# EAGLE design usain_bot_chasis (EAGLE 8.6.0)
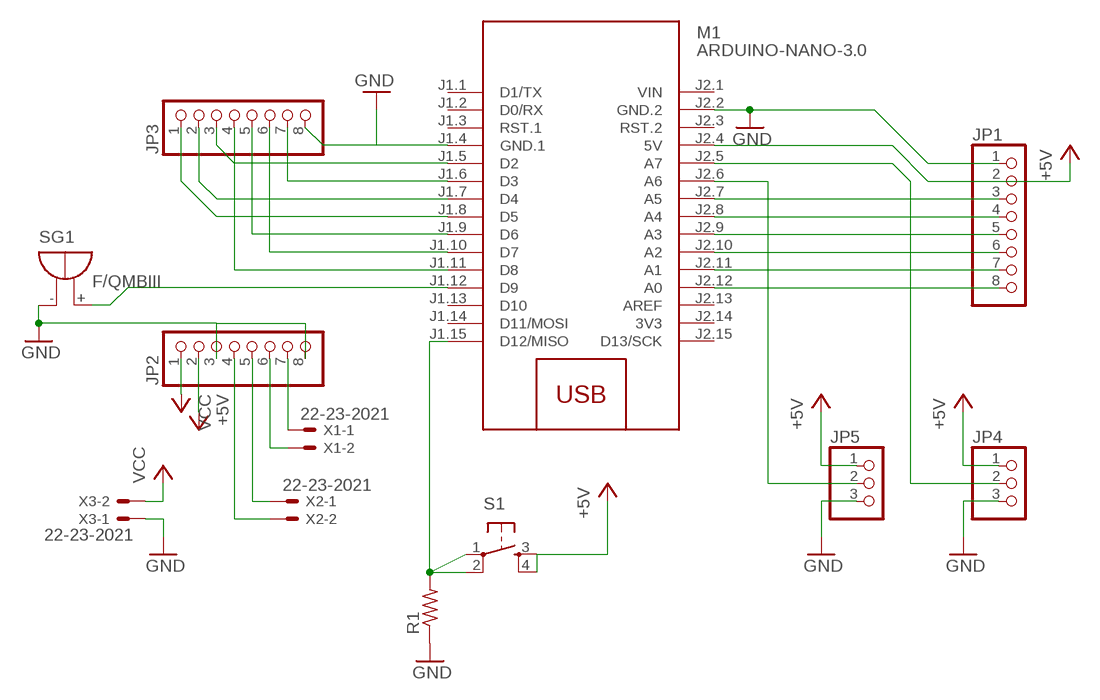
[diagram p0: schematic, sheet 1]

## Parts
JP1  PINHD-1X8BIG  [1X08-BIG]
JP2  PINHD-1X8BIG  [1X08-BIG]
JP3  PINHD-1X8BIG  [1X08-BIG]
JP4  PINHD-1X3  [1X03]
JP5  PINHD-1X3  [1X03]
M1  ARDUINO-NANO-3.0  [ARDUINO-NANO-3.0]
R1  R-US_0207/7  [0207/7]
S1  TAC_SWITCHPTH  [TACTILE-PTH]
SG1  F/QMBIII  [F/QMBIII]
X1  22-23-2021  [22-23-2021]
X2  22-23-2021  [22-23-2021]
X3  22-23-2021  [22-23-2021]

## Nets
+5V: JP1.2 JP2.2 JP4.1 JP5.1 M1.J2.4(5V) S1.3 S1.4
GND: JP1.1 JP2.3 JP2.8 JP3.8 JP4.3 JP5.3 M1.J1.4(GND.1) M1.J2.2(GND.2) R1.1 SG1.-(+) X3.1
N$1: JP1.8 M1.J2.12(A0)
N$2: JP1.7 M1.J2.11(A1)
N$3: JP1.6 M1.J2.10(A2)
N$4: JP1.5 M1.J2.9(A3)
N$5: JP1.4 M1.J2.8(A4)
N$6: JP1.3 M1.J2.7(A5)
N$8: M1.J1.15(D12/MISO) R1.2 S1.1 S1.2
N$9: JP3.7 M1.J1.6(D3)
N$10: JP3.1 M1.J1.8(D5)
N$11: JP3.2 M1.J1.7(D4)
N$12: JP3.3 M1.J1.5(D2)
N$14: JP3.5 M1.J1.9(D6)
N$15: JP3.6 M1.J1.10(D7)
N$16: JP3.4 M1.J1.11(D8)
N$17: JP2.4 X2.2
N$18: JP2.5 X2.1
N$19: JP2.6 X1.2
N$20: JP2.7 X1.1
N$21: M1.J1.12(D9) SG1.+(-)
N$22: JP5.2 M1.J2.6(A6)
N$23: JP4.2 M1.J2.5(A7)
VCC: JP2.1 X3.2
Unconnected: M1.J1.1(D1/TX) M1.J1.2(D0/RX) M1.J1.3(RST.1) M1.J1.13(D10) M1.J1.14(D11/MOSI) M1.J2.3(RST.2) M1.J2.13(AREF) M1.J2.15(D13/SCK)

## Power pins joined to a net without a drawn wire
3V3: M1.J2.14(3V3)
VIN: M1.J2.1(VIN)

## Library data of the parts
JP1-JP3 = adafruit:PINHD-1X8: PIN HEADER
JP4 JP5 = adafruit:PINHD-1X3: PIN HEADER
M1 = diy-modules:ARDUINO-NANO-3.0: Arduino Nano 3.0 and compatible devices More details available here: https://www.arduino.cc/en/Main/ArduinoBoardNano Click here to find device on ebay.com <http://www.ebay.com/sch/arduino+nano>
R1 = resistor:R-US_: RESISTOR, American symbol
S1 = SparkFun-Retired:TAC_SWITCH: Momentary Switch Button commonly used for reset or general input. Spark Fun Electronics SKU : COM-00097 SMT- SWCH-08247
SG1 = buzzer:F/QMBIII: BUZZER Source: Buerklin; OC_FARNELL: unknown; OC_NEWARK: unknown
X1-X3 = con-molex:22-23-2021: .100" (2.54mm) Center Header - 2 Pin; MF: MOLEX; MPN: 22-23-2021; OC_FARNELL: 1462926; OC_NEWARK: 25C3832

## Board
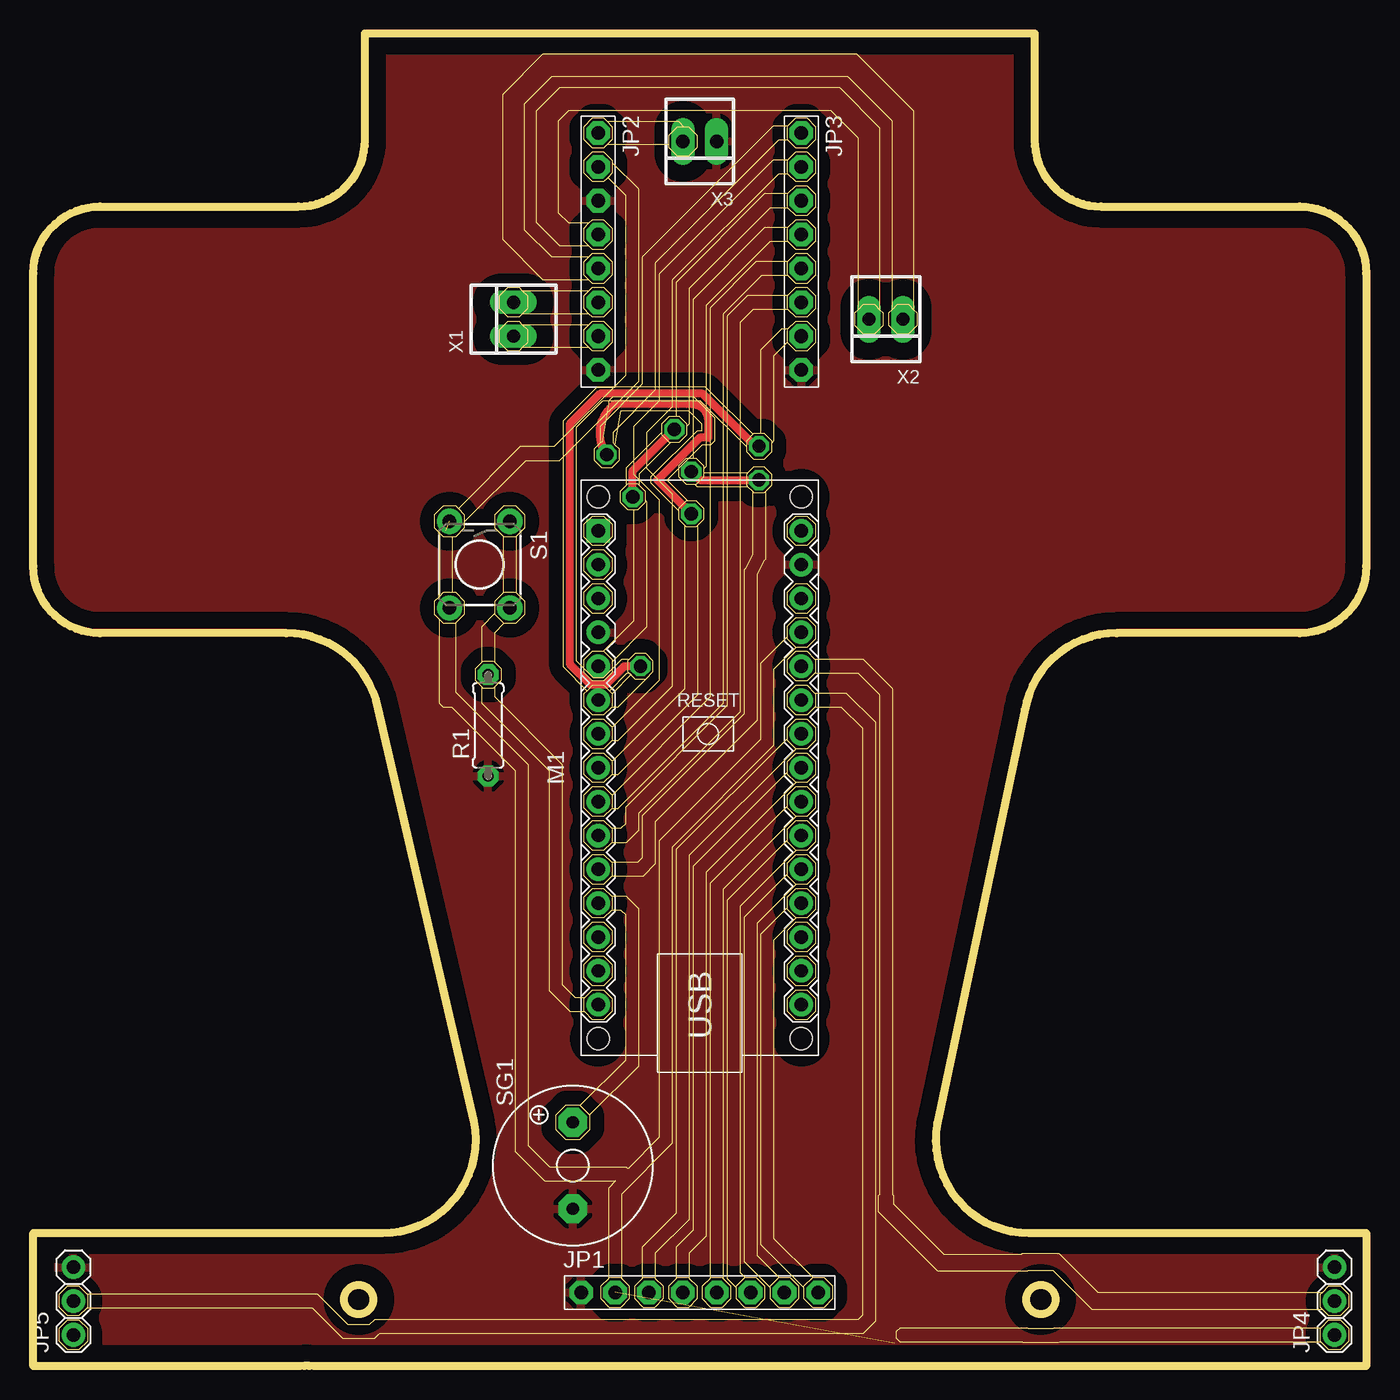
[diagram p1: board, top side]
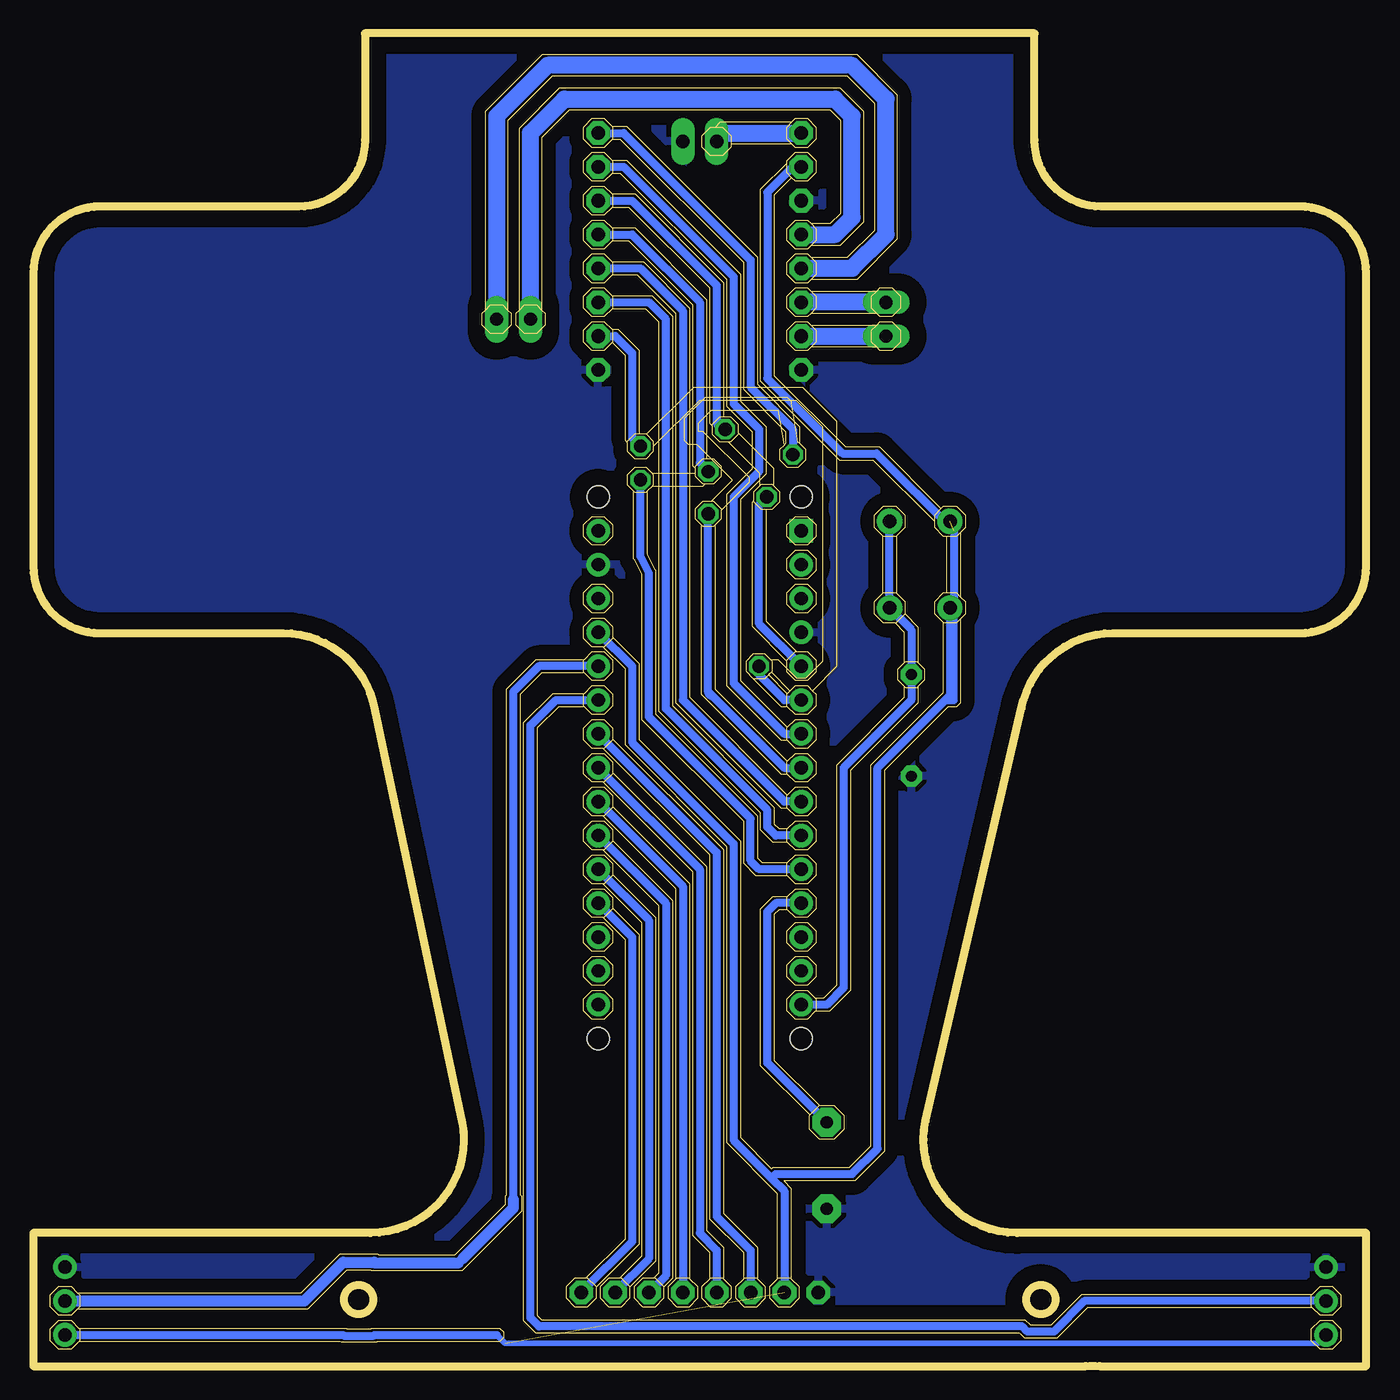
[diagram p2: board, bottom side, seen from below]

Size 100 x 100 mm. Coordinates in mm from the lower left corner, seen from the top.
Outline: 100,0 21.06,0 arc8 20,0 0,0 0,10 26.2,10 arc101 33.07,18.37 25.86,49.37 arc79 18.99,55 5,55 arc-90 0,60 0,82 arc-90 5,87 19.88,87 arc90 24.88,92 24.88,100 75.12,100 75.12,92 arc90 80.12,87 95,87 arc-90 100,82 100,60 arc-90 95,55 81.27,55 arc80 74.38,49.25 67.81,18.25 arc100 74.7,10 100,10 100,0
Outline: circle at 75.58,5 radius 1.08
Outline: circle at 24.42,5 radius 1.08
Copper layers (1*16): Top 0.035mm / dielectric 1.5mm / Bottom 0.035mm
Design rules "Fablab U. de Chile": minimum track width 0.6mm, minimum drill 0.6mm, track to track 0.3mm, track to pad 0.3mm, pad to pad 0.3mm, via to via 0.3mm, smd to smd 0.3mm, copper to edge 1mm, drill to drill 0.3mm, minimum pad ring 15mil, minimum via ring 10mil, stop-mask expansion 4mil, vias tented up to drill 0mil, thermal gap 15mil
Milling: 1051 lines

### Footprints (pad centres in the part's own frame; a part is rotated, then mirrored left to right if it is on the bottom)
1X08-BIG = drill 1.016 pad 1.778 octagon: 1 -8.89,0; 2 -6.35,0; 3 -3.81,0; 4 -1.27,0; 5 1.27,0; 6 3.81,0; 7 6.35,0; 8 8.89,0
1X03 = drill 1.016: 1 -2.54,0; 2 0,0; 3 2.54,0
ARDUINO-NANO-3.0 = drill 1 square: J1.1 17.78,7.62 | drill 1: J1.2 15.24,7.62; J1.3 12.7,7.62; J1.4 10.16,7.62; J1.5 7.62,7.62; J1.6 5.08,7.62; J1.7 2.54,7.62; J1.8 0,7.62; J1.9 -2.54,7.62; J1.10 -5.08,7.62; J1.11 -7.62,7.62; J1.12 -10.16,7.62; J1.13 -12.7,7.62; J1.14 -15.24,7.62; J1.15 -17.78,7.62; J2.1 17.78,-7.62; J2.2 15.24,-7.62; J2.3 12.7,-7.62; J2.4 10.16,-7.62; J2.5 7.62,-7.62; J2.6 5.08,-7.62; J2.7 2.54,-7.62; J2.8 0,-7.62; J2.9 -2.54,-7.62; J2.10 -5.08,-7.62; J2.11 -7.62,-7.62; J2.12 -10.16,-7.62; J2.13 -12.7,-7.62; J2.14 -15.24,-7.62; J2.15 -17.78,-7.62 | hole 1.651: -20.32,7.62; -20.32,-7.62; 20.32,-7.62; 20.32,7.62
0207/7 = drill 0.813 octagon: 1 -3.81,0; 2 3.81,0
TACTILE-PTH = drill 1.016 pad 1.88: 1 -3.251,2.261; 2 3.251,2.261; 3 -3.251,-2.261; 4 3.251,-2.261
F/QMBIII = drill 0.914 pad 2.159 octagon: + 3.251,0; - -3.251,0
22-23-2021 = drill 1 long: 1 -1.27,0; 2 1.27,0

### Placement (x,y rotation side)
JP1  50,5.53 0 top
JP2  42.38,83.63 270 top
JP3  57.62,83.63 270 top
JP4  97.62,4.89 90 top
JP5  3.01,4.89 90 top
M1  50,44.9 90 top
R1  34.12,48.07 90 top
S1  33.49,60.14 270 top
SG1  40.48,15.05 90 top
X1  36.03,78.55 90 top
X2  63.97,78.55 180 top
X3  50,91.89 180 top

### Tracks (layer width: path | path; a pad name or v marks a point on that pad's centre or on a via)
+5V  (2 unrouted)
  Bottom 0.406: 65.24,2.35 64.61,1.72 3.65,1.72 JP5.1
  Bottom 0.61: JP2.2 43.02,89.98 44.92,88.08 44.92,74.11 39.28,68.47 36.74,68.47 30.95,62.68 30.95,57.17 | 30.95,57.17 S1.4 31.23,50.33 31.58,49.98 | M1.J2.4 55.08,52.52 55.08,46.8 47.46,39.18 47.46,16.96 44.6,14.1 | 44.6,14.1 43.65,13.15 JP1.2 | 44.6,14.1 44.29,14.42 38.57,14.42 36.67,16.32 36.67,44.9 31.58,49.98 | 31.58,49.98 30.95,49.98 30.95,57.17 | JP4.1 76.76,2.35 76.7,2.29 74.46,2.29 74.4,2.35 65.24,2.35
GND
  pour Bottom (isolate 1.27): -0.8,100.78 100.17,100.78 100.17,-0.19 -0.8,-0.19
  pour Top (isolate 1.27): -0.8,101.41 100.17,101.41 100.17,-0.82 -0.8,-0.82
N$1
  Bottom 0.61: M1.J2.12 55.08,32.2 55.08,9.34 JP1.8
N$2
  Bottom 0.61: M1.J2.11 53.81,33.47 53.81,8.07 JP1.7
N$3
  Bottom 0.61: M1.J2.10 52.54,34.74 52.54,6.8 JP1.6
N$4
  Bottom 0.61: M1.J2.9 51.27,36.01 JP1.5
N$5
  Bottom 0.61: M1.J2.8 50,37.28 50,9.97 48.73,8.7 JP1.4
N$6
  Bottom 0.61: M1.J2.7 48.73,38.55 48.73,11.24 46.19,8.7 JP1.3
N$8
  Bottom 0.61: S1.1 S1.2 34.12,55.26 R1.2 34.12,49.98 39.21,44.9 39.21,28.39 40.48,27.12 M1.J1.15
N$9  (via drill 1 pad 1.3)
  Top 0.61: v54.45,69.03 54.16,69.03 50.22,72.96 42.52,72.96 40.23,70.68 40.23,52.7 41.8,51.13 42.96,51.13 44.34,52.52 v45.55,52.52
  Bottom 0.61: M1.J1.6 43.65,49.98 45.55,51.88 v45.55,52.52 | JP3.7 56.35,77.28 55.08,76.01 55.08,69.66 v54.45,69.03
N$10  (via drill 1 pad 1.3)
  Top 0.61: v43.02,68.39 arc-90 43.65,72.2 49.37,72.2 arc-90 50.64,70.93 50.64,69.66 50,69.66 46.83,66.49 v49.37,63.95
  Bottom 0.61: M1.J1.8 43.65,44.9 49.05,50.29 | JP3.1 55.72,92.52 46.19,83 46.19,73.47 43.02,70.3 v43.02,68.39 | 49.37,50.61 49.05,50.29 | 49.05,50.29 arc90 49.37,50.61 | 49.37,50.61 v49.37,63.95 | 49.05,50.29 arc90 49.37,50.61
N$11
  Bottom 0.61: M1.J1.7 43.65,47.44 47.46,51.25 47.46,65.22 45.55,67.12 45.55,70.3 47.46,72.2 47.46,81.73 55.72,89.98 JP3.2
N$12  (via drill 1 pad 1.3)
  Top 0.61: v44.97,65.22 44.97,67.17 v48.1,70.3
  Bottom 0.61: JP3.3 55.08,87.44 48.73,81.09 48.73,70.93 arc-90 v48.1,70.3 | M1.J1.5 45.55,55.69 45.55,64.63 v44.97,65.22
N$14
  Bottom 0.61: M1.J1.9 43.65,42.36 51.27,49.98 51.27,79.19 54.45,82.36 JP3.5
N$15
  Bottom 0.61: M1.J1.10 44.29,39.82 44.92,40.45 44.92,41.72 52.54,49.34 52.54,78.55 53.81,79.82 JP3.6
N$16  (via drill 1 pad 1.3)
  Top 0.61: v49.37,67.12 50,66.49 v54.45,66.49
  Bottom 0.61: M1.J1.11 45.55,37.28 46.19,37.91 46.19,41.09 53.81,48.71 53.81,59.5 54.45,60.77 v54.45,66.49 | v49.37,67.12 50,67.76 50,79.82 55.08,84.9 JP3.4
N$17
  Bottom 1.27: JP2.4 39.84,84.9 38.57,86.17 38.57,93.79 39.84,95.06 60.16,95.06 62.7,92.52 X2.2
N$18
  Bottom 1.27: JP2.5 38.57,82.36 36.03,84.9 36.03,95.06 38.57,97.6 61.43,97.6 65.24,93.79 X2.1
N$19
  Bottom 1.27: X1.2 JP2.6
N$20
  Bottom 1.27: JP2.7 X1.1
N$21
  Bottom 0.61: M1.J1.12 44.29,34.74 44.92,34.1 44.92,22.75 SG1.+
N$22
  Bottom 0.61: JP5.2 21.13,4.89 23.43,2.6 25.41,2.6 25.8,2.99 62.07,2.99 62.7,3.62 62.7,48.07 60.8,49.98 M1.J2.6
N$23
  Bottom 0.61: M1.J2.5 62.07,52.52 63.97,50.61 63.97,12.51 | 68.1,7.75 67.78,8.07
  Bottom 0.813: JP4.2 79.66,4.89 76.74,7.81 74.42,7.81 74.36,7.75 68.1,7.75 | 67.78,8.07 63.97,11.88 63.97,12.51
VCC
  Bottom 1.27: X3.2 48.1,92.52 JP2.1